# Altium schematic sheet Preset Selection.SchDoc: Preset Selection
size A4; SheetNumber: 4; SheetTotal: 7
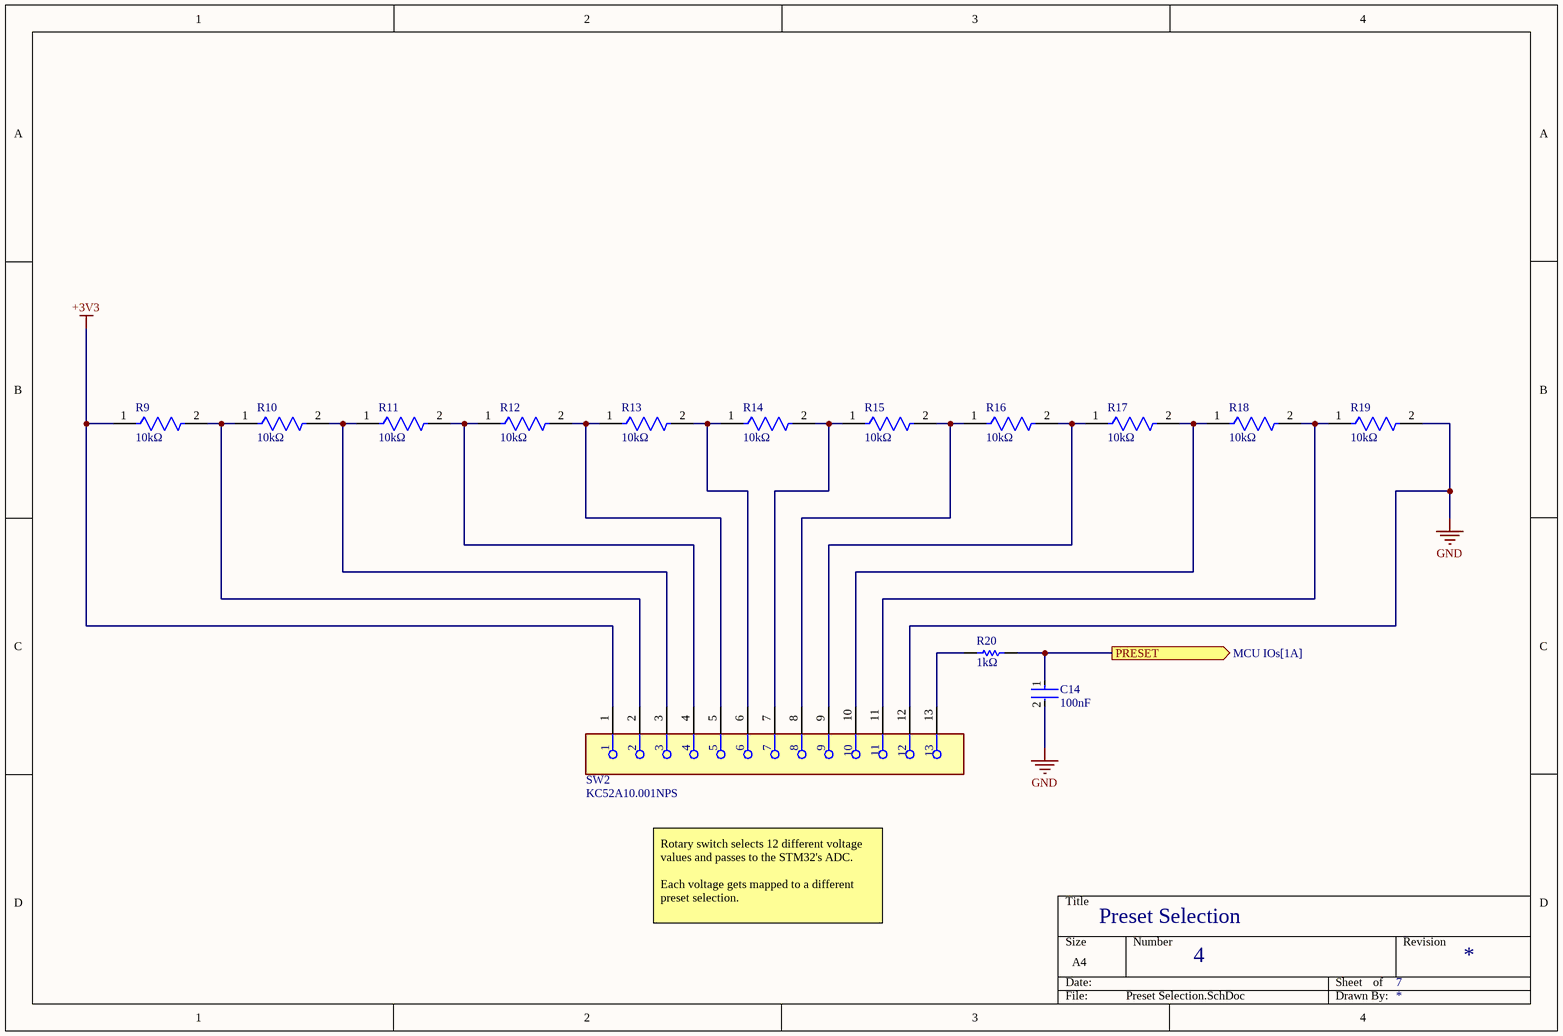
[diagram p0: Preset Selection.SchDoc]

## Parts
C14  100nF  [FP-C0805C-DN-MFG]
R9  10kΩ  [FP-MCU0805-IPC_C]
R10  10kΩ  [FP-MCU0805-IPC_C]
R11  10kΩ  [FP-MCU0805-IPC_C]
R12  10kΩ  [FP-MCU0805-IPC_C]
R13  10kΩ  [FP-MCU0805-IPC_C]
R14  10kΩ  [FP-MCU0805-IPC_C]
R15  10kΩ  [FP-MCU0805-IPC_C]
R16  10kΩ  [FP-MCU0805-IPC_C]
R17  10kΩ  [FP-MCU0805-IPC_C]
R18  10kΩ  [FP-MCU0805-IPC_C]
R19  10kΩ  [FP-MCU0805-IPC_C]
R20  1kΩ  [RESC2013X55X40ML15T20]
SW2  KC52A10.001NPS  [PCBComponent_1]

## Ports
PRESET (out, see MCU IOs[1A])

## Nets
+3V3: R9.1 SW2.1
GND: C14.2 R19.2 SW2.12
PRESET: C14.1 R20.2 ; port PRESET
NetR9_2: R9.2 R10.1 SW2.2
NetR10_2: R10.2 R11.1 SW2.3
NetR11_2: R11.2 R12.1 SW2.4
NetR12_2: R12.2 R13.1 SW2.5
NetR13_2: R13.2 R14.1 SW2.6
NetR14_2: R14.2 R15.1 SW2.7
NetR15_2: R15.2 R16.1 SW2.8
NetR16_2: R16.2 R17.1 SW2.9
NetR17_2: R17.2 R18.1 SW2.10
NetR18_2: R18.2 R19.1 SW2.11
NetR20_1: R20.1 SW2.13

## Notes on the sheet
- Rotary switch selects 12 different voltage values and passes to the STM32's ADC.
  Each voltage gets mapped to a different preset selection.

## Library data of the parts
C14 = CMP-03020-002348-1: CAP CER 0.1UF 50V X7R 0805; Manufacturer: KEMET; Manufacturer Part Number: C0805C104J5RACAUTO; Material: Ceramic; Tolerance: 0.05; Capacitance: 0.10 μF; Value: 0.10 μF; Temperature Coefficient: 30ppm/°C; Voltage Rating: 50 V; ComponentLink2URL: https://content.kemet.com/datasheets/KEM_C1003_C0G_SMD.pdf; Temperature Characteristic: X7R; Device Class L2: Capacitors; Ipc Land Pattern Name: CAPC200125X78; Lead Free: Yes; Device Class L1: Passive Components; Package: C0805C-DN; Temperature Range High: +125°C; Octopart: https://octopart.com/c0805c104j5racauto-kemet-22884343; Temperature: -55°C to +125°C; ComponentLink2Description: Datasheet; Height: 0.88mm; Digikey Description: CAP CER 0.1UF 50V X7R 0805; Category: Cap; Temperature Range Low: -55°C; RoHS: TRUE; Device Class L3: Ceramic Capacitors; Automotive: No
R9-R19 = CMP-02407-010343-1: RES 1.05K OHM 0.5% 1/5W 0805; Tolerance: 0.1%; Temperature Coefficient: 10ppm/°C; Max Power Dissipation: 125mW; Resistance: 10kR; Military Standard: Not; Min Operating Temperature: -55°C; Length: 0.079inch; Composition: Thin Film; Case/Package: 0805; Package Quantity: 1000; Number of Terminations: 2; Lead Free: Lead Free; Width: 0.049inch; Depth: 1.25mm; Height: 0.022inch; Max Operating Temperature: 125°C; Packaging: Tape and Reel
R20 = CMP-2001-04687-1: Manufacturer: Vishay Dale; Part Number: TNPW08051K00BETA
SW2 = KC52A10.001NPS: Rotary Switch 12 Position SP12T 350mA (AC) 125 VAC Panel Mount, Through Hole